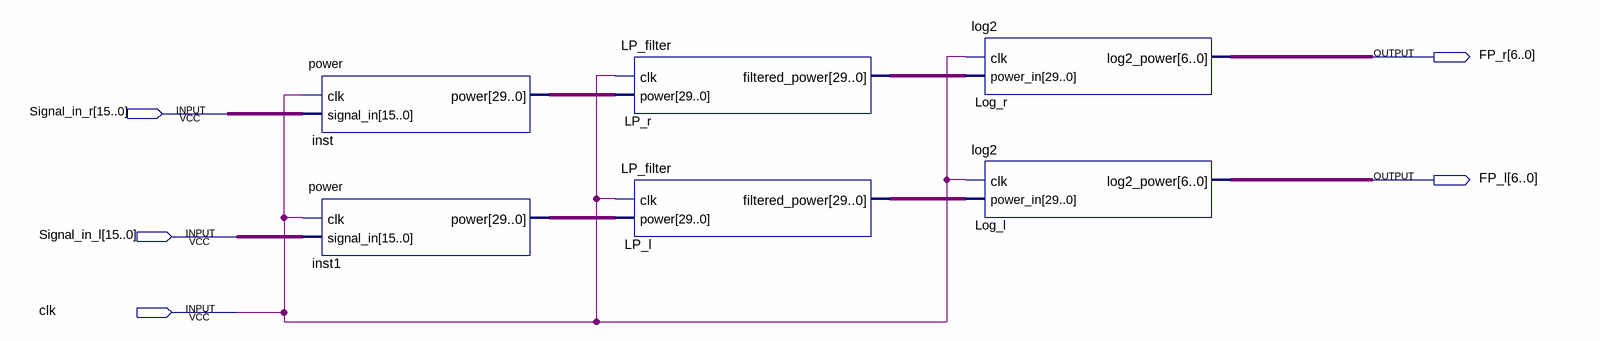
[diagram p0: schematic sheet]
// Quartus schematic LP_right_left.bdf as structural Verilog: 6 symbols, 5 pins
module LP_right_left (
  input  [15:0] Signal_in_r,
  input  [15:0] Signal_in_l,
  input  clk,
  output [6:0] FP_r,
  output [6:0] FP_l
);

  wire [29:0] inst1_power, inst_power, LP_l_filtered_power, LP_r_filtered_power;

  power inst (.clk(clk), .signal_in(Signal_in_r), .power(inst_power));
  power inst1 (.clk(clk), .signal_in(Signal_in_l), .power(inst1_power));
  LP_filter LP_r (.clk(clk), .power(inst_power), .filtered_power(LP_r_filtered_power));
  LP_filter LP_l (.clk(clk), .power(inst1_power), .filtered_power(LP_l_filtered_power));
  log2 Log_r (.clk(clk), .power_in(LP_r_filtered_power), .log2_power(FP_r));
  log2 Log_l (.clk(clk), .power_in(LP_l_filtered_power), .log2_power(FP_l));
endmodule
